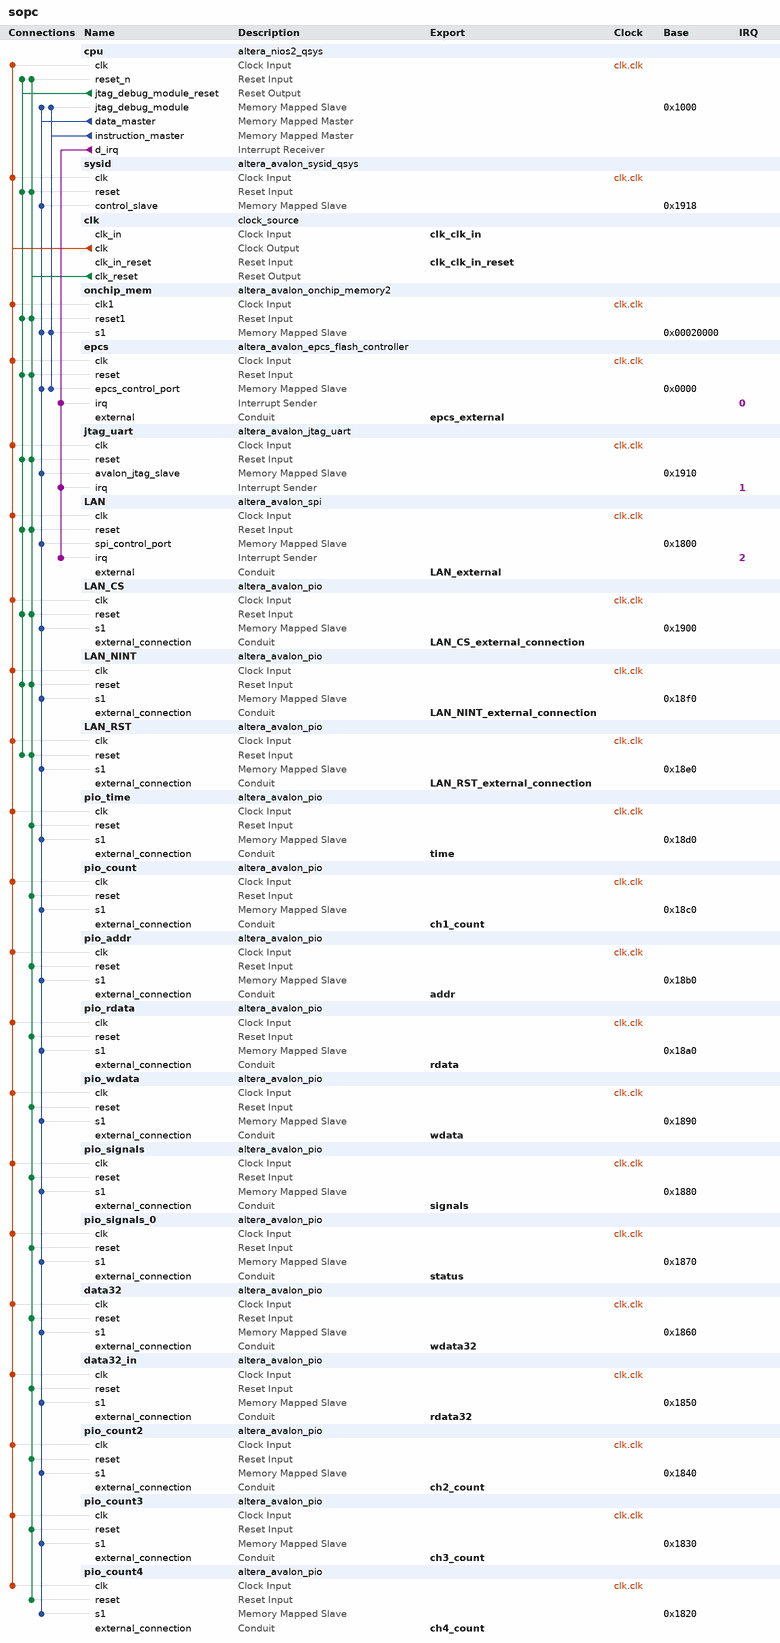
[diagram p0: system contents]
# Platform Designer (Qsys) system sopc, Cyclone III EP3C16F484C6
# Parameters at their usual value, and those the tool derives, are not listed.
package require -exact qsys 13.1
create_system sopc
set_project_property DEVICE_FAMILY {Cyclone III}
set_project_property DEVICE EP3C16F484C6

add_instance cpu altera_nios2_qsys 13.1
set_instance_parameter_value cpu manuallyAssignCpuID false
set_instance_parameter_value cpu resetSlave onchip_mem.s1
set_instance_parameter_value cpu exceptionSlave onchip_mem.s1
set_instance_parameter_value cpu breakSlave cpu.jtag_debug_module
set_instance_parameter_value cpu impl Tiny
set_instance_parameter_value cpu icache_size 2048
set_instance_parameter_value cpu dcache_size 0

add_instance sysid altera_avalon_sysid_qsys 13.1
set_instance_parameter_value sysid id 0

add_instance clk clock_source 13.1
set_instance_parameter_value clk clockFrequency 50000000

add_instance onchip_mem altera_avalon_onchip_memory2 13.1
set_instance_parameter_value onchip_mem dataWidth 32
set_instance_parameter_value onchip_mem dualPort false
set_instance_parameter_value onchip_mem initMemContent true
set_instance_parameter_value onchip_mem initializationFileName onchip_mem
set_instance_parameter_value onchip_mem memorySize 43000

add_instance epcs altera_avalon_epcs_flash_controller 13.1

add_instance jtag_uart altera_avalon_jtag_uart 13.1
set_instance_parameter_value jtag_uart simInteractiveOptions INTERACTIVE_ASCII_OUTPUT

add_instance LAN altera_avalon_spi 13.1
set_instance_parameter_value LAN clockPolarity 0
set_instance_parameter_value LAN dataWidth 8
set_instance_parameter_value LAN masterSPI true
set_instance_parameter_value LAN numberOfSlaves 1
set_instance_parameter_value LAN targetClockRate 500000

add_instance LAN_CS altera_avalon_pio 13.1
set_instance_parameter_value LAN_CS direction Output
set_instance_parameter_value LAN_CS width 1

add_instance LAN_NINT altera_avalon_pio 13.1
set_instance_parameter_value LAN_NINT direction Input
set_instance_parameter_value LAN_NINT width 1

add_instance LAN_RST altera_avalon_pio 13.1
set_instance_parameter_value LAN_RST direction Output
set_instance_parameter_value LAN_RST width 1

add_instance pio_time altera_avalon_pio 13.1
set_instance_parameter_value pio_time direction Input
set_instance_parameter_value pio_time width 32

add_instance pio_count altera_avalon_pio 13.1
set_instance_parameter_value pio_count direction Input
set_instance_parameter_value pio_count width 32

add_instance pio_addr altera_avalon_pio 13.1
set_instance_parameter_value pio_addr direction Output
set_instance_parameter_value pio_addr width 8

add_instance pio_rdata altera_avalon_pio 13.1
set_instance_parameter_value pio_rdata direction Input
set_instance_parameter_value pio_rdata width 8

add_instance pio_wdata altera_avalon_pio 13.1
set_instance_parameter_value pio_wdata direction Output
set_instance_parameter_value pio_wdata width 8

add_instance pio_signals altera_avalon_pio 13.1
set_instance_parameter_value pio_signals direction Output
set_instance_parameter_value pio_signals width 8

add_instance pio_signals_0 altera_avalon_pio 13.1
set_instance_parameter_value pio_signals_0 direction Input
set_instance_parameter_value pio_signals_0 width 8

add_instance data32 altera_avalon_pio 13.1
set_instance_parameter_value data32 direction Output
set_instance_parameter_value data32 width 32

add_instance data32_in altera_avalon_pio 13.1
set_instance_parameter_value data32_in direction Output
set_instance_parameter_value data32_in width 32

add_instance pio_count2 altera_avalon_pio 13.1
set_instance_parameter_value pio_count2 direction Input
set_instance_parameter_value pio_count2 width 32

add_instance pio_count3 altera_avalon_pio 13.1
set_instance_parameter_value pio_count3 direction Input
set_instance_parameter_value pio_count3 width 32

add_instance pio_count4 altera_avalon_pio 13.1
set_instance_parameter_value pio_count4 direction Input
set_instance_parameter_value pio_count4 width 32

# connections
add_connection clk.clk cpu.clk clock
add_connection clk.clk data32.clk clock
add_connection clk.clk data32_in.clk clock
add_connection clk.clk epcs.clk clock
add_connection clk.clk jtag_uart.clk clock
add_connection clk.clk LAN.clk clock
add_connection clk.clk LAN_CS.clk clock
add_connection clk.clk LAN_NINT.clk clock
add_connection clk.clk LAN_RST.clk clock
add_connection clk.clk onchip_mem.clk1 clock
add_connection clk.clk pio_addr.clk clock
add_connection clk.clk pio_count2.clk clock
add_connection clk.clk pio_count3.clk clock
add_connection clk.clk pio_count4.clk clock
add_connection clk.clk pio_count.clk clock
add_connection clk.clk pio_rdata.clk clock
add_connection clk.clk pio_signals.clk clock
add_connection clk.clk pio_signals_0.clk clock
add_connection clk.clk pio_time.clk clock
add_connection clk.clk pio_wdata.clk clock
add_connection clk.clk sysid.clk clock
add_connection clk.clk_reset cpu.reset_n reset
add_connection clk.clk_reset data32.reset reset
add_connection clk.clk_reset data32_in.reset reset
add_connection clk.clk_reset epcs.reset reset
add_connection clk.clk_reset jtag_uart.reset reset
add_connection clk.clk_reset LAN.reset reset
add_connection clk.clk_reset LAN_CS.reset reset
add_connection clk.clk_reset LAN_NINT.reset reset
add_connection clk.clk_reset LAN_RST.reset reset
add_connection clk.clk_reset onchip_mem.reset1 reset
add_connection clk.clk_reset pio_addr.reset reset
add_connection clk.clk_reset pio_count2.reset reset
add_connection clk.clk_reset pio_count3.reset reset
add_connection clk.clk_reset pio_count4.reset reset
add_connection clk.clk_reset pio_count.reset reset
add_connection clk.clk_reset pio_rdata.reset reset
add_connection clk.clk_reset pio_signals.reset reset
add_connection clk.clk_reset pio_signals_0.reset reset
add_connection clk.clk_reset pio_time.reset reset
add_connection clk.clk_reset pio_wdata.reset reset
add_connection clk.clk_reset sysid.reset reset
add_connection cpu.jtag_debug_module_reset cpu.reset_n reset
add_connection cpu.jtag_debug_module_reset epcs.reset reset
add_connection cpu.jtag_debug_module_reset jtag_uart.reset reset
add_connection cpu.jtag_debug_module_reset LAN.reset reset
add_connection cpu.jtag_debug_module_reset LAN_CS.reset reset
add_connection cpu.jtag_debug_module_reset LAN_NINT.reset reset
add_connection cpu.jtag_debug_module_reset LAN_RST.reset reset
add_connection cpu.jtag_debug_module_reset onchip_mem.reset1 reset
add_connection cpu.jtag_debug_module_reset sysid.reset reset
add_connection cpu.data_master cpu.jtag_debug_module avalon
set_connection_parameter_value cpu.data_master/cpu.jtag_debug_module baseAddress 0x1000
add_connection cpu.data_master data32.s1 avalon
set_connection_parameter_value cpu.data_master/data32.s1 baseAddress 0x1860
add_connection cpu.data_master data32_in.s1 avalon
set_connection_parameter_value cpu.data_master/data32_in.s1 baseAddress 0x1850
add_connection cpu.data_master epcs.epcs_control_port avalon
set_connection_parameter_value cpu.data_master/epcs.epcs_control_port baseAddress 0x0000
add_connection cpu.data_master jtag_uart.avalon_jtag_slave avalon
set_connection_parameter_value cpu.data_master/jtag_uart.avalon_jtag_slave baseAddress 0x1910
add_connection cpu.data_master LAN.spi_control_port avalon
set_connection_parameter_value cpu.data_master/LAN.spi_control_port baseAddress 0x1800
add_connection cpu.data_master LAN_CS.s1 avalon
set_connection_parameter_value cpu.data_master/LAN_CS.s1 baseAddress 0x1900
add_connection cpu.data_master LAN_NINT.s1 avalon
set_connection_parameter_value cpu.data_master/LAN_NINT.s1 baseAddress 0x18f0
add_connection cpu.data_master LAN_RST.s1 avalon
set_connection_parameter_value cpu.data_master/LAN_RST.s1 baseAddress 0x18e0
add_connection cpu.data_master onchip_mem.s1 avalon
set_connection_parameter_value cpu.data_master/onchip_mem.s1 baseAddress 0x00020000
add_connection cpu.data_master pio_addr.s1 avalon
set_connection_parameter_value cpu.data_master/pio_addr.s1 baseAddress 0x18b0
add_connection cpu.data_master pio_count2.s1 avalon
set_connection_parameter_value cpu.data_master/pio_count2.s1 baseAddress 0x1840
add_connection cpu.data_master pio_count3.s1 avalon
set_connection_parameter_value cpu.data_master/pio_count3.s1 baseAddress 0x1830
add_connection cpu.data_master pio_count4.s1 avalon
set_connection_parameter_value cpu.data_master/pio_count4.s1 baseAddress 0x1820
add_connection cpu.data_master pio_count.s1 avalon
set_connection_parameter_value cpu.data_master/pio_count.s1 baseAddress 0x18c0
add_connection cpu.data_master pio_rdata.s1 avalon
set_connection_parameter_value cpu.data_master/pio_rdata.s1 baseAddress 0x18a0
add_connection cpu.data_master pio_signals.s1 avalon
set_connection_parameter_value cpu.data_master/pio_signals.s1 baseAddress 0x1880
add_connection cpu.data_master pio_signals_0.s1 avalon
set_connection_parameter_value cpu.data_master/pio_signals_0.s1 baseAddress 0x1870
add_connection cpu.data_master pio_time.s1 avalon
set_connection_parameter_value cpu.data_master/pio_time.s1 baseAddress 0x18d0
add_connection cpu.data_master pio_wdata.s1 avalon
set_connection_parameter_value cpu.data_master/pio_wdata.s1 baseAddress 0x1890
add_connection cpu.data_master sysid.control_slave avalon
set_connection_parameter_value cpu.data_master/sysid.control_slave baseAddress 0x1918
add_connection cpu.instruction_master cpu.jtag_debug_module avalon
set_connection_parameter_value cpu.instruction_master/cpu.jtag_debug_module baseAddress 0x1000
add_connection cpu.instruction_master epcs.epcs_control_port avalon
set_connection_parameter_value cpu.instruction_master/epcs.epcs_control_port baseAddress 0x0000
add_connection cpu.instruction_master onchip_mem.s1 avalon
set_connection_parameter_value cpu.instruction_master/onchip_mem.s1 baseAddress 0x00020000
add_connection cpu.d_irq epcs.irq interrupt
set_connection_parameter_value cpu.d_irq/epcs.irq irqNumber 0
add_connection cpu.d_irq jtag_uart.irq interrupt
set_connection_parameter_value cpu.d_irq/jtag_uart.irq irqNumber 1
add_connection cpu.d_irq LAN.irq interrupt
set_connection_parameter_value cpu.d_irq/LAN.irq irqNumber 2

# exported interfaces
add_interface clk_clk_in_reset reset sink
set_interface_property clk_clk_in_reset EXPORT_OF clk.clk_in_reset
add_interface LAN_RST_external_connection conduit end
set_interface_property LAN_RST_external_connection EXPORT_OF LAN_RST.external_connection
add_interface LAN_CS_external_connection conduit end
set_interface_property LAN_CS_external_connection EXPORT_OF LAN_CS.external_connection
add_interface LAN_external conduit end
set_interface_property LAN_external EXPORT_OF LAN.external
add_interface clk_clk_in clock sink
set_interface_property clk_clk_in EXPORT_OF clk.clk_in
add_interface LAN_NINT_external_connection conduit end
set_interface_property LAN_NINT_external_connection EXPORT_OF LAN_NINT.external_connection
add_interface epcs_external conduit end
set_interface_property epcs_external EXPORT_OF epcs.external
add_interface time conduit end
set_interface_property time EXPORT_OF pio_time.external_connection
add_interface ch1_count conduit end
set_interface_property ch1_count EXPORT_OF pio_count.external_connection
add_interface addr conduit end
set_interface_property addr EXPORT_OF pio_addr.external_connection
add_interface rdata conduit end
set_interface_property rdata EXPORT_OF pio_rdata.external_connection
add_interface wdata conduit end
set_interface_property wdata EXPORT_OF pio_wdata.external_connection
add_interface signals conduit end
set_interface_property signals EXPORT_OF pio_signals.external_connection
add_interface status conduit end
set_interface_property status EXPORT_OF pio_signals_0.external_connection
add_interface wdata32 conduit end
set_interface_property wdata32 EXPORT_OF data32.external_connection
add_interface rdata32 conduit end
set_interface_property rdata32 EXPORT_OF data32_in.external_connection
add_interface ch2_count conduit end
set_interface_property ch2_count EXPORT_OF pio_count2.external_connection
add_interface ch3_count conduit end
set_interface_property ch3_count EXPORT_OF pio_count3.external_connection
add_interface ch4_count conduit end
set_interface_property ch4_count EXPORT_OF pio_count4.external_connection

set_interconnect_requirement {$system} qsys_mm.clockCrossingAdapter HANDSHAKE
set_interconnect_requirement {$system} qsys_mm.maxAdditionalLatency 0

save_system sopc.qsys
